# Altium schematic sheet MOTO.SchDoc
size A3
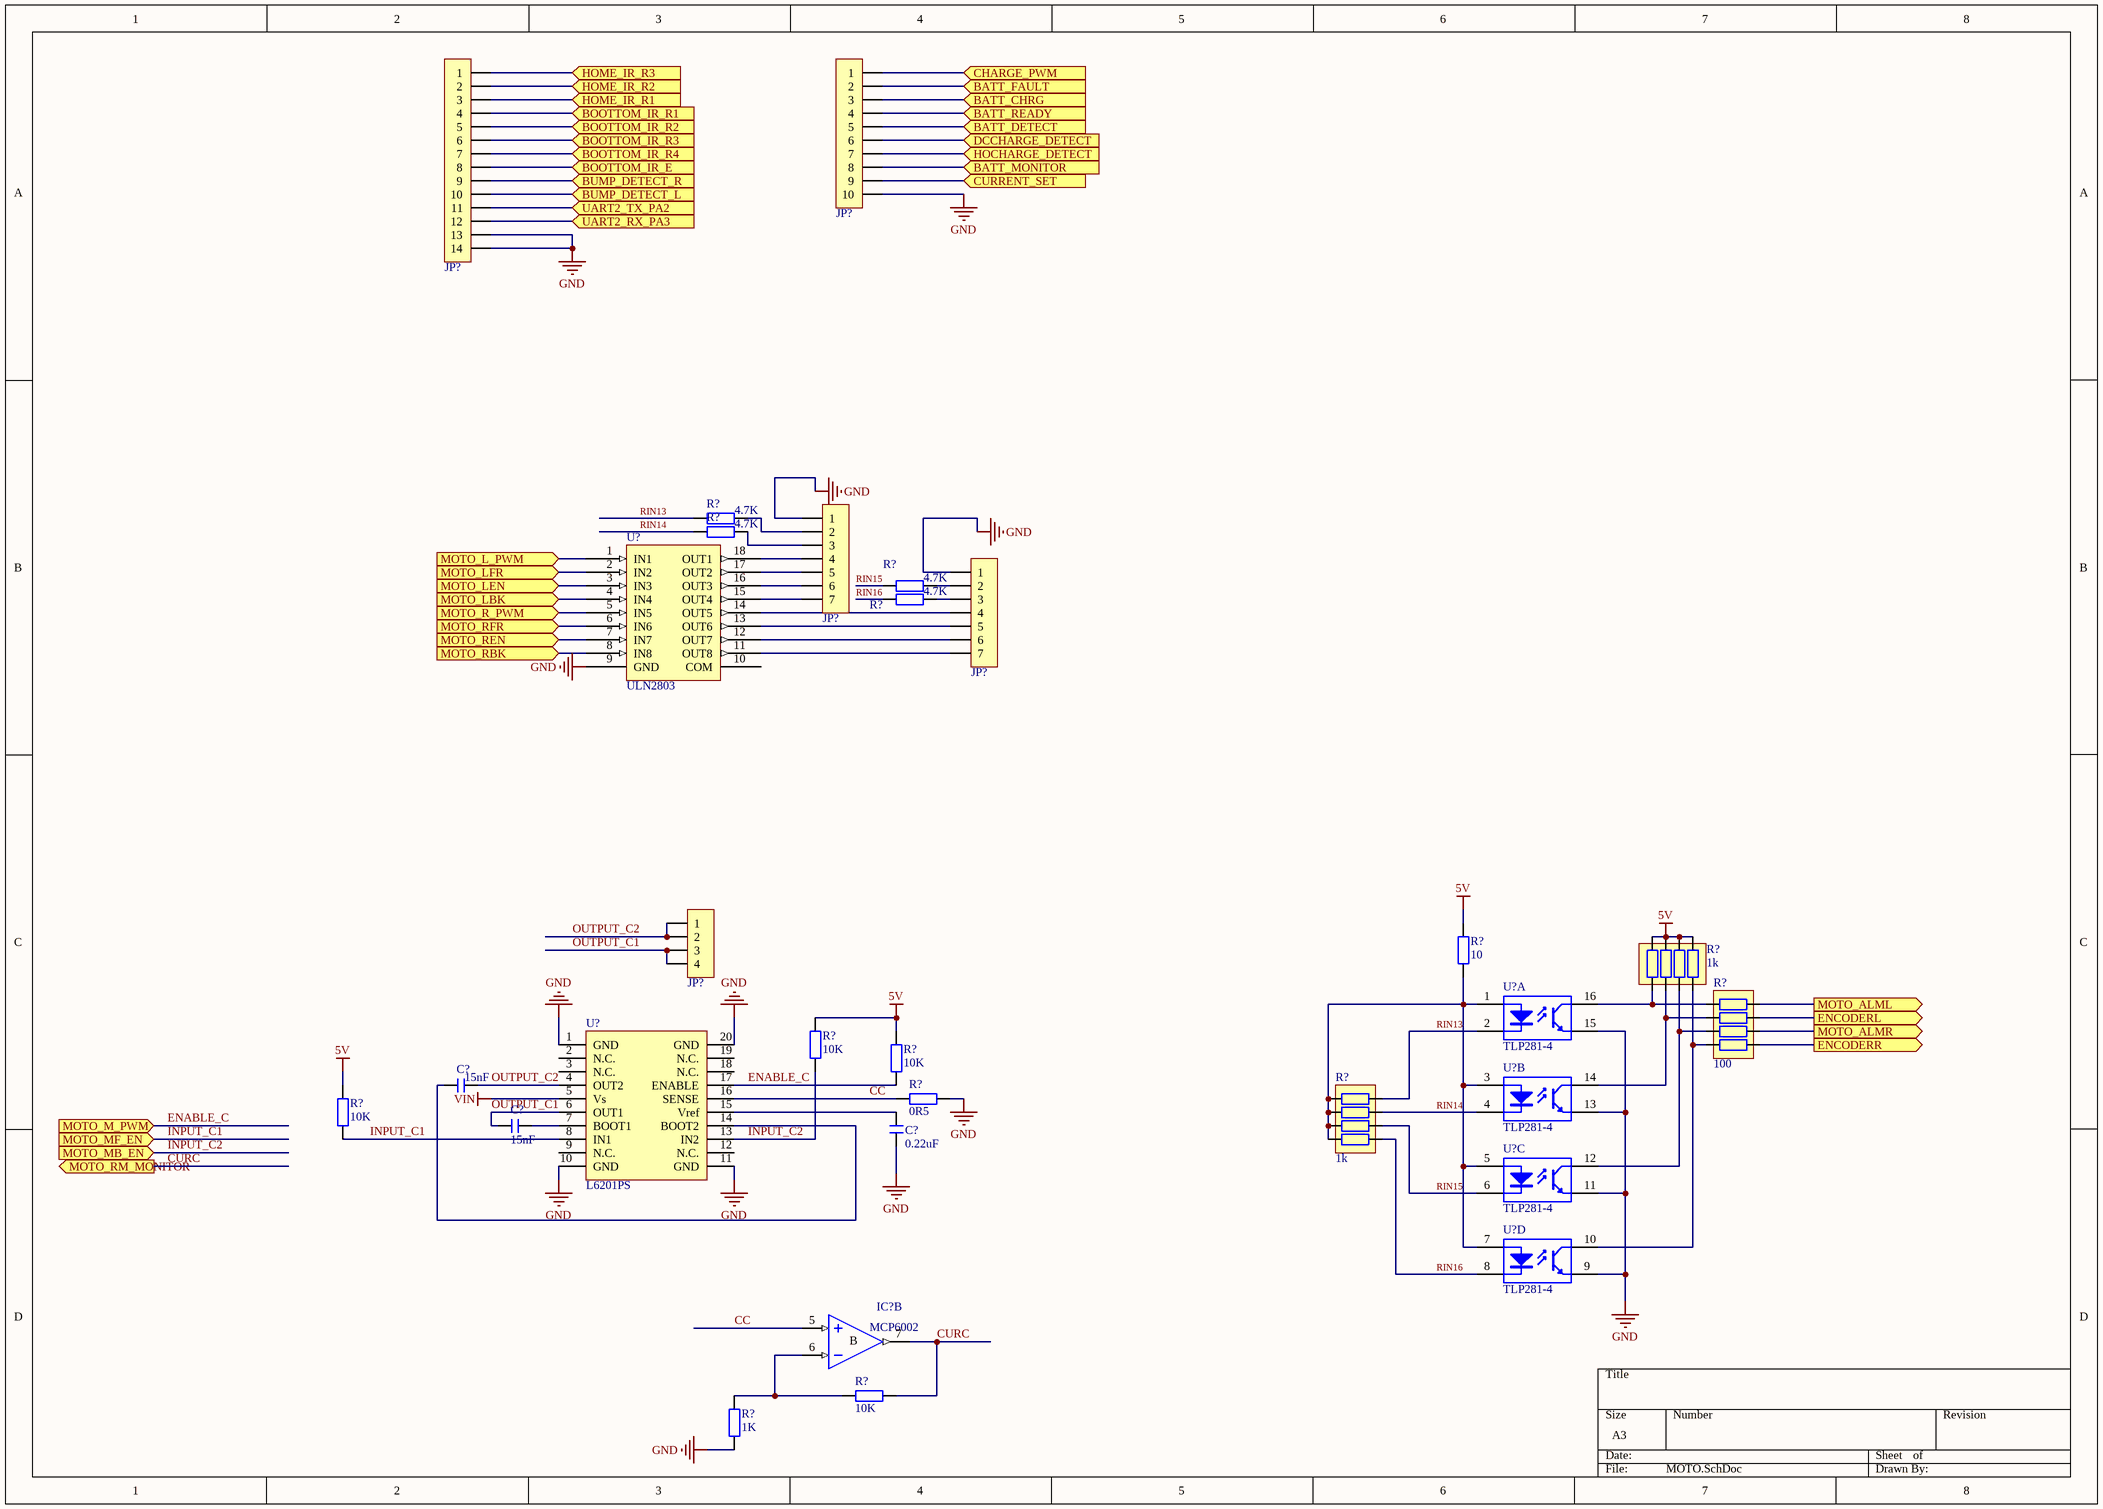
[diagram p0: MOTO.SchDoc]

## Parts
(Parts that share a designator on the sheet are numbered #1, #2 ... from top to bottom, then left to right.)
C?#1  15nF  [C 0603_L]
C?#2  15nF  [C 0603_L]
C?#3  0.22uF  [C 0603_L]
IC?  MCP6002  [SOP8_N]  (part B of 2)
JP?#1  HDR-1X14  [HDR-1X14]  (value not drawn)
JP?#2  HDR-1X10  [HDR-1X10]  (value not drawn)
JP?#3  HDR-1X7  [XH2.54-WI-7P]  (value not drawn)
JP?#4  HDR-1X7  [XH2.54-WI-7P]  (value not drawn)
JP?#5  HDR-1X4  [XH2.54-WI-4P]  (value not drawn)
R?#1  4.7K  [R 0603_L]
R?#2  4.7K  [R 0603_L]
R?#3  4.7K  [R 0603_L]
R?#4  4.7K  [R 0603_L]
R?#5  10  [R 0603_L]
R?#6  1k  [RCA-8P4R-0603]
R?#7  100  [RCA-8P4R-0603]
R?#8  10K  [R 0603_L]
R?#9  10K  [R 0603_L]
R?#10  0R5  [RS 3W-V7]
R?#11  1k  [RCA-8P4R-0603]
R?#12  10K  [R 0603_L]
R?#13  10K  [R 0603_L]
R?#14  1K  [R 0603_L]
U?#1  ULN2803  [SO-G18]
U?#2  TLP281-4  [SOP16N_N]  (part A of 4)
U?#3  L6201PS  [SO_PowerSO20]
U?#4  TLP281-4  [SOP16N_n]  (part B of 4)
U?#5  TLP281-4  [SOP16N_n]  (part C of 4)
U?#6  TLP281-4  [SOP16N_n]  (part D of 4)

## Ports
BATT_CHRG (in), BATT_DETECT (in), BATT_FAULT (in), BATT_MONITOR (in), BATT_READY (in), BOOTTOM_IR_E (in), BOOTTOM_IR_R1 (in), BOOTTOM_IR_R2 (in), BOOTTOM_IR_R3 (in), BOOTTOM_IR_R4 (in), BUMP_DETECT_L (in), BUMP_DETECT_R (in), CHARGE_PWM (in), CURRENT_SET (in), DCCHARGE_DETECT (in), ENCODERL (out), ENCODERR (out), HOCHARGE_DETECT (in), HOME_IR_R1 (in), HOME_IR_R2 (in), HOME_IR_R3 (in), MOTO_ALML (out), MOTO_ALMR (out), MOTO_L_PWM (in), MOTO_LBK (in), MOTO_LEN (in), MOTO_LFR (in), MOTO_M_PWM (in), MOTO_MB_EN (in), MOTO_MF_EN (in), MOTO_R_PWM (in), MOTO_RBK (in), MOTO_REN (in), MOTO_RFR (in), MOTO_RM_MONITOR (out), UART2_RX_PA3 (in), UART2_TX_PA2 (in)

## Nets
5V: R?#5.1 R?#6.5 R?#6.6 R?#6.7 R?#6.8 R?#8.2 R?#9.2 R?#12.2
GND: C?#3.1 JP?#1.13 JP?#1.14 JP?#2.10 JP?#3.1 JP?#4.1 R?#10.2 R?#14.1 U?#1.9(GND) U?#2.15 U?#3.1(GND) U?#3.10(GND) U?#3.11(GND) U?#3.20(GND) U?#4.13 U?#5.11 U?#6.9
VIN: U?#3.5(Vs)
BATT_CHRG: JP?#2.3 ; port BATT_CHRG
BATT_DETECT: JP?#2.5 ; port BATT_DETECT
BATT_FAULT: JP?#2.2 ; port BATT_FAULT
BATT_MONITOR: JP?#2.8 ; port BATT_MONITOR
BATT_READY: JP?#2.4 ; port BATT_READY
BOOTTOM_IR_E: JP?#1.8 ; port BOOTTOM_IR_E
BOOTTOM_IR_R1: JP?#1.4 ; port BOOTTOM_IR_R1
BOOTTOM_IR_R2: JP?#1.5 ; port BOOTTOM_IR_R2
BOOTTOM_IR_R3: JP?#1.6 ; port BOOTTOM_IR_R3
BOOTTOM_IR_R4: JP?#1.7 ; port BOOTTOM_IR_R4
BUMP_DETECT_L: JP?#1.10 ; port BUMP_DETECT_L
BUMP_DETECT_R: JP?#1.9 ; port BUMP_DETECT_R
CC: IC?.5(IN+) R?#10.1 U?#3.16(SENSE)
CHARGE_PWM: JP?#2.1 ; port CHARGE_PWM
CURC: IC?.7(OUT) R?#13.2 ; port MOTO_RM_MONITOR
CURRENT_SET: JP?#2.9 ; port CURRENT_SET
DCCHARGE_DETECT: JP?#2.6 ; port DCCHARGE_DETECT
ENABLE_C: R?#9.1 U?#3.17(ENABLE) ; port MOTO_M_PWM
ENCODERL: R?#7.2 ; port ENCODERL
ENCODERR: R?#7.4 ; port ENCODERR
HOCHARGE_DETECT: JP?#2.7 ; port HOCHARGE_DETECT
HOME_IR_R1: JP?#1.3 ; port HOME_IR_R1
HOME_IR_R2: JP?#1.2 ; port HOME_IR_R2
HOME_IR_R3: JP?#1.1 ; port HOME_IR_R3
INPUT_C1: R?#12.1 U?#3.8(IN1) ; port MOTO_MF_EN
INPUT_C2: R?#8.1 U?#3.13(IN2) ; port MOTO_MB_EN
MOTO_ALML: R?#7.1 ; port MOTO_ALML
MOTO_ALMR: R?#7.3 ; port MOTO_ALMR
MOTO_L_PWM: U?#1.1(IN1) ; port MOTO_L_PWM
MOTO_LBK: U?#1.4(IN4) ; port MOTO_LBK
MOTO_LEN: U?#1.3(IN3) ; port MOTO_LEN
MOTO_LFR: U?#1.2(IN2) ; port MOTO_LFR
MOTO_R_PWM: U?#1.5(IN5) ; port MOTO_R_PWM
MOTO_RBK: U?#1.8(IN8) ; port MOTO_RBK
MOTO_REN: U?#1.7(IN7) ; port MOTO_REN
MOTO_RFR: U?#1.6(IN6) ; port MOTO_RFR
OUTPUT_C1: C?#2.1 JP?#5.3 JP?#5.4 U?#3.6(OUT1)
OUTPUT_C2: C?#1.2 JP?#5.1 JP?#5.2 U?#3.4(OUT2)
RIN13: R?#1.2 R?#11.8 U?#2.2
RIN14: R?#2.2 R?#11.7 U?#4.4
RIN15: R?#3.2 R?#11.6 U?#5.6
RIN16: R?#4.2 R?#11.5 U?#6.8
UART2_RX_PA3: JP?#1.12 ; port UART2_RX_PA3
UART2_TX_PA2: JP?#1.11 ; port UART2_TX_PA2
NetC?#1_1: C?#1.1 U?#3.14(BOOT2)
NetC?#2_2: C?#2.2 U?#3.7(BOOT1)
NetC?#3_2: C?#3.2 U?#3.15(Vref)
NetIC?_6: IC?.6(IN-) R?#13.1 R?#14.2
NetJP?#3_2: JP?#3.2 R?#1.1
NetJP?#3_3: JP?#3.3 R?#2.1
NetJP?#3_4: JP?#3.4 U?#1.18(OUT1)
NetJP?#3_5: JP?#3.5 U?#1.17(OUT2)
NetJP?#3_6: JP?#3.6 U?#1.16(OUT3)
NetJP?#3_7: JP?#3.7 U?#1.15(OUT4)
NetJP?#4_2: JP?#4.2 R?#3.1
NetJP?#4_3: JP?#4.3 R?#4.1
NetJP?#4_4: JP?#4.4 U?#1.14(OUT5)
NetJP?#4_5: JP?#4.5 U?#1.13(OUT6)
NetJP?#4_6: JP?#4.6 U?#1.12(OUT7)
NetJP?#4_7: JP?#4.7 U?#1.11(OUT8)
NetR?#5_2: R?#5.2 R?#11.1 R?#11.2 R?#11.3 R?#11.4 U?#2.1 U?#4.3 U?#5.5 U?#6.7
NetR?#6_1: R?#6.1 R?#7.8 U?#2.16
NetR?#6_2: R?#6.2 R?#7.7 U?#4.14
NetR?#6_3: R?#6.3 R?#7.6 U?#5.12
NetR?#6_4: R?#6.4 R?#7.5 U?#6.10

Not connected (* = marked no-connect by the designer): U?#1 10(COM); U?#3 2(N.C.) 3(N.C.) 9(N.C.) 12(N.C.) 18(N.C.) 19(N.C.)

## Notes on the sheet
- (in symbol LM358, part B) B

## Library data of the parts
C?#1-C?#3 = C: 无极性贴片电容; 版权归属: 源创客; BOM名称: 无极性贴片电容; 学习资源: www.ooocke.com
IC? = LM358: 双路运放; 版权归属: 源创客; BOM名称: 双路运放; 学习资源: www.ooocke.com
JP?#1 = Header 14: 14P接插件; 版权归属: 源创客; BOM名称: 14P接插件; 学习资源: www.ooocke.com
JP?#2 = Header 10: 10P接插件; 版权归属: 源创客; BOM名称: 10P接插件; 学习资源: www.ooocke.com
JP?#3 JP?#4 = Header 7: 7P接插件; 版权归属: 源创客; BOM名称: 7P接插件; 学习资源: www.ooocke.com
JP?#5 = Header 4: 4P接插件; 版权归属: 源创客; BOM名称: 4P接插件; 学习资源: www.ooocke.com
R?#1-R?#5 R?#8 R?#9 R?#12-R?#14 = R: 贴片电阻; 版权归属: 源创客; BOM名称: 贴片电阻; 学习资源: www.ooocke.com
R?#6 R?#7 R?#11 = R-8P4R: 贴片网络排阻; 版权归属: 源创客; BOM名称: 贴片网络排阻; 学习资源: www.ooocke.com
R?#10 = R-CRR: 直插色环电阻; BOM名称: 色环电阻; 版权归属: 源创客; 学习资源: www.ooocke.com
U?#3 = L6201PS: 电机驱动H桥